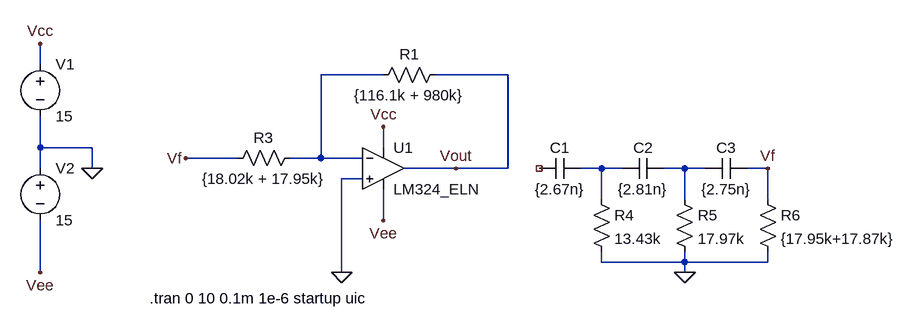
[diagram p0: schematic 1_real_with_phase_opt_isolated.asc]
1_real_with_phase_opt_isolated.asc, the LTspice schematic file:
Version 4
SHEET 1 1012 680
WIRE -336 -48 -336 -80
WIRE 192 -32 96 -32
WIRE 384 -32 272 -32
WIRE -336 80 -336 32
WIRE -256 80 -336 80
WIRE 192 80 192 48
WIRE -32 96 -112 96
WIRE 96 96 96 -32
WIRE 96 96 48 96
WIRE 160 96 96 96
WIRE -336 112 -336 80
WIRE -256 112 -256 80
WIRE 304 112 224 112
WIRE 384 112 384 -32
WIRE 384 112 304 112
WIRE 528 112 496 112
WIRE 560 112 528 112
WIRE 656 112 624 112
WIRE 688 112 656 112
WIRE 784 112 752 112
WIRE 160 128 128 128
WIRE 528 160 528 112
WIRE 656 160 656 112
WIRE 784 160 784 112
WIRE 192 192 192 144
WIRE 528 256 528 240
WIRE 656 256 656 240
WIRE 656 256 528 256
WIRE 784 256 784 240
WIRE 784 256 656 256
WIRE -336 272 -336 192
WIRE 128 272 128 128
WIRE 656 272 656 256
FLAG -336 -80 Vcc
FLAG -336 272 Vee
FLAG -256 112 0
FLAG 128 272 0
FLAG 656 272 0
FLAG 784 112 Vf
FLAG -112 96 Vf
FLAG 192 192 Vee
FLAG 192 48 Vcc
FLAG 304 112 Vout
SYMBOL res 288 -48 R90
WINDOW 0 0 56 VBottom 2
WINDOW 3 32 56 VTop 2
SYMATTR InstName R1
SYMATTR Value {116.1k + 980k}
SYMBOL voltage -336 -64 R0
WINDOW 123 0 0 Left 0
WINDOW 39 0 0 Left 0
SYMATTR InstName V1
SYMATTR Value 15
SYMBOL voltage -336 96 R0
WINDOW 123 0 0 Left 0
WINDOW 39 0 0 Left 0
SYMATTR InstName V2
SYMATTR Value 15
SYMBOL res 64 80 R90
WINDOW 0 0 56 VBottom 2
WINDOW 3 32 56 VTop 2
SYMATTR InstName R3
SYMATTR Value {18.02k + 17.95k}
SYMBOL cap 496 96 R90
WINDOW 0 0 32 VBottom 2
WINDOW 3 32 32 VTop 2
SYMATTR InstName C1
SYMATTR Value {2.67n}
SYMBOL cap 624 96 R90
WINDOW 0 0 32 VBottom 2
WINDOW 3 32 32 VTop 2
SYMATTR InstName C2
SYMATTR Value {2.81n}
SYMBOL cap 752 96 R90
WINDOW 0 0 32 VBottom 2
WINDOW 3 32 32 VTop 2
SYMATTR InstName C3
SYMATTR Value {2.75n}
SYMBOL res 512 144 R0
SYMATTR InstName R4
SYMATTR Value 13.43k
SYMBOL res 640 144 R0
SYMATTR InstName R5
SYMATTR Value 17.97k
SYMBOL res 768 144 R0
SYMATTR InstName R6
SYMATTR Value {17.95k+17.87k}
SYMBOL ELN_IFSC\\LM324_ELN 192 112 R0
SYMATTR InstName U1
TEXT -168 312 Left 2 !.tran 0 10 0.1m 1e-6 startup uic

The netlist it stands for:
* 1_real_with_phase_opt_isolated.asc
R1 Vout N001 {116.1k + 980k}
V1 Vcc 0 15
V2 0 Vee 15
R3 N001 Vf {18.02k + 17.95k}
C1 N002 NC_01 {2.67n}
C2 N003 N002 {2.81n}
C3 Vf N003 {2.75n}
R4 N002 0 13.43k
R5 N003 0 17.97k
R6 Vf 0 {17.95k+17.87k}
* U1: LM324_ELN (symbol ELN_IFSC\LM324_ELN not available, pins judged from their places): In+=0 In-=N001 V+=Vcc V-=Vee OUT=Vout
.tran 0 10 0.1m 1e-6 startup uic
.backanno
.end